# EAGLE schematic Final_5(1) (EAGLE 9.2.2)
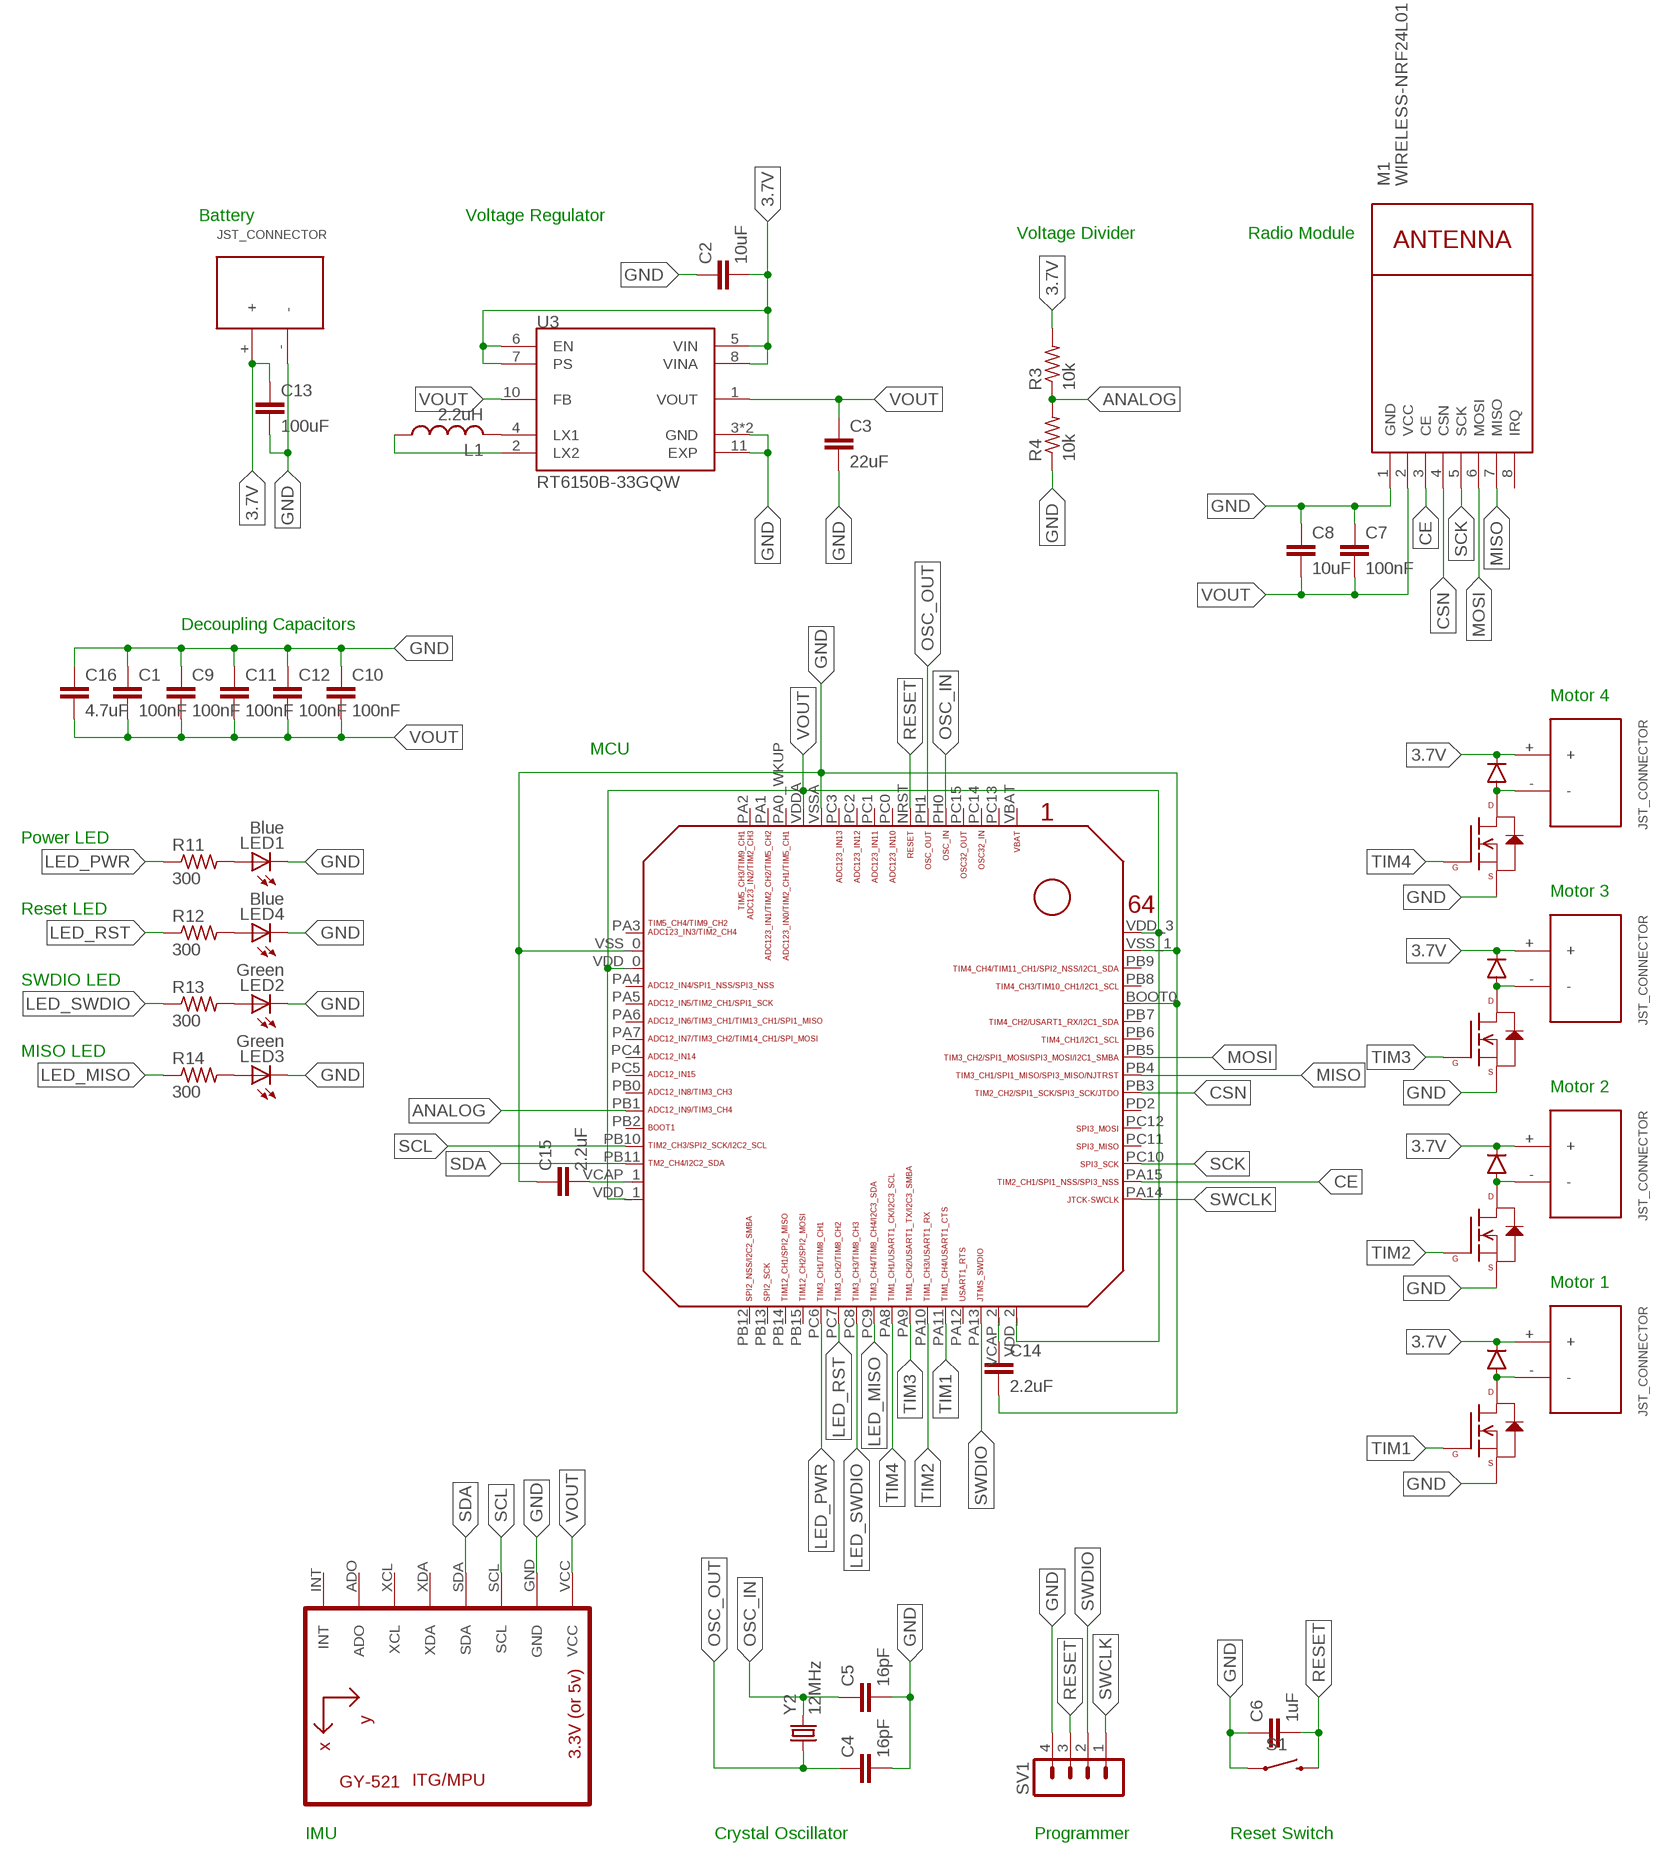
[diagram p0: schematic, sheet 1]

## Parts
C1  100nF  C-EUC0603  [C0603]
C2  10uF  C-EUC0603  [C0603]
C3  22uF  C-EUC0603  [C0603]
C4  16pF  C-EUC0603  [C0603]
C5  16pF  C-EUC0603  [C0603]
C6  1uF  C-EUC0603  [C0603]
C7  100nF  C-EUC0603  [C0603]
C8  10uF  C-EUC0603  [C0603]
C9  100nF  C-EUC0603  [C0603]
C10  100nF  C-EUC0603  [C0603]
C11  100nF  C-EUC0603  [C0603]
C12  100nF  C-EUC0603  [C0603]
C13  100uF  C-EUC1206  [C1206]
C14  2.2uF  C-EUC0603  [C0603]
C15  2.2uF  C-EUC0603  [C0603]
C16  4.7uF  C-EUC0603  [C0603]
L1  2.2uH  L-USL0603  [L0603]
LED1  Blue  LEDCHIP-LED0603  [CHIP-LED0603]
LED2  Green  LEDCHIP-LED0603  [CHIP-LED0603]
LED3  Green  LEDCHIP-LED0603  [CHIP-LED0603]
LED4  Blue  LEDCHIP-LED0603  [CHIP-LED0603]
M1  WIRELESS-NRF24L01  [WIRELESS-NRF24L01]
R3  10k  R-US_R0603  [R0603]
R4  10k  R-US_R0603  [R0603]
R11  300  R-US_R0603  [R0603]
R12  300  R-US_R0603  [R0603]
R13  300  R-US_R0603  [R0603]
R14  300  R-US_R0603  [R0603]
S1  SWITCH-MOMENTARY-2SMD  [TACTILE-SWITCH-SMD]
SV1  MA04-1  [MA04-1]
U2  GY-521MPU6050  [GY-521]
U3  RT6150B-33GQW  [SON50P250X250X80-11N]
U$1  STM32F405/415_LQFP64  [STM32F405/415_LQFP64]
U$2  JST_CONNECTOR_FEMALE  [JST_CONNECTOR_FEMALE]
U$3  JST_CONNECTOR_FEMALE  [JST_CONNECTOR_FEMALE]
U$4  JST_CONNECTOR_FEMALE  [JST_CONNECTOR_FEMALE]
U$5  JST_CONNECTOR_FEMALE  [JST_CONNECTOR_FEMALE]
U$6  JST_CONNECTOR_FEMALE  [JST_CONNECTOR_FEMALE]
U$7  N-CHANNEL-MOSFET-IRLML6244TRPBF  [SOT23-3]
U$8  N-CHANNEL-MOSFET-IRLML6244TRPBF  [SOT23-3]
U$9  N-CHANNEL-MOSFET-IRLML6244TRPBF  [SOT23-3]
U$10  N-CHANNEL-MOSFET-IRLML6244TRPBF  [SOT23-3]
U$11  DB2W40300L  [MINI2-F3-B]
U$12  DB2W40300L  [MINI2-F3-B]
U$13  DB2W40300L  [MINI2-F3-B]
U$14  DB2W40300L  [MINI2-F3-B]
Y2  12MHz  CRYSTALSMD  [HC49UP]

## Nets
3.7V: C2.2 C13.1 R3.2 U3.5(VIN) U3.6(EN) U3.7(PS) U3.8(VINA) U$2.+ U$3.+ U$4.+ U$5.+ U$6.+ U$11.NEG(GPIN) U$12.NEG(GPIN) U$13.NEG(GPIN) U$14.NEG(GPIN)
ANALOG: R3.1 R4.2 U$1.PB1
CE: M1.3(CE) U$1.PA15
CSN: M1.4(CSN) U$1.PB3
GND: C1.1 C2.1 C3.2 C4.2 C5.2 C6.1 C7.1 C8.1 C9.1 C10.1 C11.1 C12.1 C13.2 C14.2 C15.1 C16.1 LED1.C LED2.C LED3.C LED4.C M1.1(GND) R4.1 S1.1 SV1.4 U2.GND U3.3(GND) U3.9(GND) U3.11(EXP) U$1.BOOT0 U$1.VSS_0 U$1.VSS_1 U$1.VSSA U$2.- U$7.2(S) U$8.2(S) U$9.2(S) U$10.2(S)
LED_MISO: R14.1 U$1.PC9
LED_PWR: R11.1 U$1.PC6
LED_RST: R12.1 U$1.PC7
LED_SWDIO: R13.1 U$1.PC8
MISO: M1.7(MISO) U$1.PB4
MOSI: M1.6(MOSI) U$1.PB5
N$1: L1.2 U3.4(LX1)
N$2: L1.1 U3.2(LX2)
N$4: U$3.- U$9.3(D) U$11.POS(PPIN)
N$5: U$5.- U$8.3(D) U$12.POS(PPIN)
N$6: U$4.- U$7.3(D) U$13.POS(PPIN)
N$7: U$6.- U$10.3(D) U$14.POS(PPIN)
N$8: LED1.A R11.2
N$9: LED4.A R12.2
N$10: LED2.A R13.2
N$11: LED3.A R14.2
N$12: C15.2 U$1.VCAP_1
N$13: C14.1 U$1.VCAP_2
OSC_IN: C5.1 U$1.PH0 Y2.2
OSC_OUT: C4.1 U$1.PH1 Y2.1
RESET: C6.2 S1.3 SV1.3 U$1.NRST
SCK: M1.5(SCK) U$1.PC10
SCL: U2.SCL U$1.PB10
SDA: U2.SDA U$1.PB11
SWCLK: SV1.1 U$1.PA14
SWDIO: SV1.2 U$1.PA13
TIM1: U$1.PA11 U$10.1(G)
TIM2: U$1.PA10 U$8.1(G)
TIM3: U$1.PA9 U$7.1(G)
TIM4: U$1.PA8 U$9.1(G)
VOUT: C1.2 C3.1 C7.2 C8.2 C9.2 C10.2 C11.2 C12.2 C16.2 M1.2(VCC) U2.VCC U3.1(VOUT) U3.10(FB) U$1.VDD_0 U$1.VDD_1 U$1.VDD_2 U$1.VDD_3 U$1.VDDA
Unconnected: M1.8(IRQ) U2.ADO U2.INT U2.XCL U2.XDA U$1.PA0_WKUP(PA0_AKUP) U$1.PA1 U$1.PA2 U$1.PA3 U$1.PA4 U$1.PA5 U$1.PA6 U$1.PA7 U$1.PA12 U$1.PB0 U$1.PB2 U$1.PB6 U$1.PB7 U$1.PB8 U$1.PB9 U$1.PB12 U$1.PB13 U$1.PB14 U$1.PB15 U$1.PC0 U$1.PC1 U$1.PC2 U$1.PC3 U$1.PC4 U$1.PC5 U$1.PC11 U$1.PC12 U$1.PC13 U$1.PC14 U$1.PC15 U$1.PD2 U$1.VBAT

## Notes on the sheet
- Battery | Voltage Regulator
- Voltage Divider | Radio Module
- Decoupling Capacitors
- Motor 4
- MCU
- Power LED
- Motor 3
- Reset LED
- SWDIO LED
- MISO LED
- Motor 2
- Motor 1
- IMU | Crystal Oscillator | Programmer | Reset Switch

## Library data of the parts
C1-C13 C16 = rcl:C-EU: CAPACITOR, European symbol; SPICEPREFIX: C
C14 C15 = rcl:C-EU: CAPACITOR, European symbol
L1 = rcl-2:L-US: INDUCTOR, American symbol
LED1-LED4 = led:LED: LED OSRAM: - CHIPLED LG R971, LG N971, LY N971, LG Q971, LY Q971, LO R971, LY R971 LH N974, LH R974 LS Q976, LO Q976, LY Q976 LO Q996 - Hyper CHIPLED LW Q18S LB Q993, LB Q99A, LB R99A - SideLED LS A670, LO A670, LY A670, LG A670, LP A670 LB A673, LV A673, LT A673, LW A673 LH A674 LY A675 LS A676, LA A676, LO A676, LY A676, LW A676 LS A679, LY A679, LG A679 - Hyper Micro SIDELED® LS Y876, LA Y876, LO Y876, LY Y876 LT Y87S - SmartLED LW L88C, LW L88S LB L89C, LB L89S, LG L890 LS L89K, LO L89K, LY L89K LS L896, LA L896, LO L896, LY L896 - TOPLED LS T670, LO T670, LY T670, LG T670, LP T670 LSG T670, LSP T670, LSY T670, LOP T670, LYG T670 LG T671, LOG T671, LSG T671 LB T673, LV T673, LT T673, LW T673 LH T674 LS T676, LA T676, LO T676, LY T676, LB T676, LH T676, LSB T676, LW T676 LB T67C, LV T67C, LT T67C, LS T67K, LO T67K, LY T67K, LW E67C LS E67B, LA E67B, LO E67B, LY E67B, LB E67C, LV E67C, LT E67C LW T67C LS T679, LY T679, LG T679 LS T770, LO T770, LY T770, LG T770, LP T770 LB T773, LV T773, LT T773, LW T773 LH T774 LS E675, LA E675, LY E675, LS T675 LS T776, LA T776, LO T776, LY T776, LB T776 LHGB T686 LT T68C, LB T68C - Hyper Mini TOPLED® LB M676 - Mini TOPLED Santana® LG M470 LS M47K, LO M47K, LY M47K Source: http://www.osram.convergy.de LUXEON: - LUMILED® LXK2-PW12-R00, LXK2-PW12-S00, LXK2-PW14-U00, LXK2-PW14-V00 LXK2-PM12-R00, LXK2-PM12-S00, LXK2-PM14-U00 LXK2-PE12-Q00, LXK2-PE12-R00, LXK2-PE12-S00, LXK2-PE14-T00, LXK2-PE14-U00 LXK2-PB12-K00, LXK2-PB12-L00, LXK2-PB12-M00, LXK2-PB14-N00, LXK2-PB14-P00, LXK2-PB14-Q00 LXK2-PR12-L00, LXK2-PR12-M00, LXK2-PR14-Q00, LXK2-PR14-R00 LXK2-PD12-Q00, LXK2-PD12-R00, LXK2-PD12-S00 LXK2-PH12-R00, LXK2-PH12-S00 LXK2-PL12-P00, LXK2-PL12-Q00, LXK2-PL12-R00 Source: www.luxeon.com KINGBRIGHT: KA-3528ASYC Source: www.kingbright.com
M1 = AP_quad:WIRELESS-NRF24L01: 2.4 GHz Wireless Module based on NRF24L01 chip
R3 R4 R11-R14 = rcl:R-US_: RESISTOR, American symbol; SPICEPREFIX: R
S1 = AP_quad:SWITCH-MOMENTARY-2: Various NO switches- pushbuttons, reed, etc; PROD_ID: SWCH-08247
SV1 = con-lstb:MA04-1: PIN HEADER; OC_FARNELL: unknown; OC_NEWARK: unknown
U2 = AP_quad:GY-521
U3 = RT6150B-33GQW:RT6150B-33GQW: Dc/Dc Conv, Buck-Boost, 1mhz, Wdfn-10; DESCRIPTION: Dc/Dc Conv, Buck-Boost, 1mhz, Wdfn-10; DIGI-KEY_PART_NUMBER: RT6150B-33GQWCT-ND; DIGI-KEY_PURCHASE_URL: https://www.digikey.com/product-detail/en/richtek-usa-inc/RT6150B-33GQW/RT6150B-33GQWCT-ND/6676777?utm_source=snapeda&utm_medium=aggregator&utm_campaign=symbol; MF: Richtek USA; MP: RT6150B-33GQW; PACKAGE: WFDFN-10 Richtek
U$1 = AP_quad:STM32F405/415_LQFP64
U$2-U$6 = AP_quad:JST_CONNECTOR_FEMALE
U$7-U$10 = AP_quad:N-CHANNEL-MOSFET: N-Channel MOSFET Mode Field Effect Transistor; DATASHEET: http://www.mouser.com/ds/2/196/irlml6244pbf-936666.pdf; MOUSER: 942-IRLML6244TRPBF; URL: http://www.mouser.com/Search/ProductDetail.aspx?R=IRLML6244TRPBFvirtualkey57370000virtualkey942-IRLML6244TRPBF
U$11-U$14 = AP_quad:DB2W40300L
Y2 = AP_quad:CRYSTAL: Crystals Various standard crystals. Proven footprints. Spark Fun Electronics SKU : COM-00534